# EAGLE design RoboSkinRev1 (EAGLE 9.4.2)
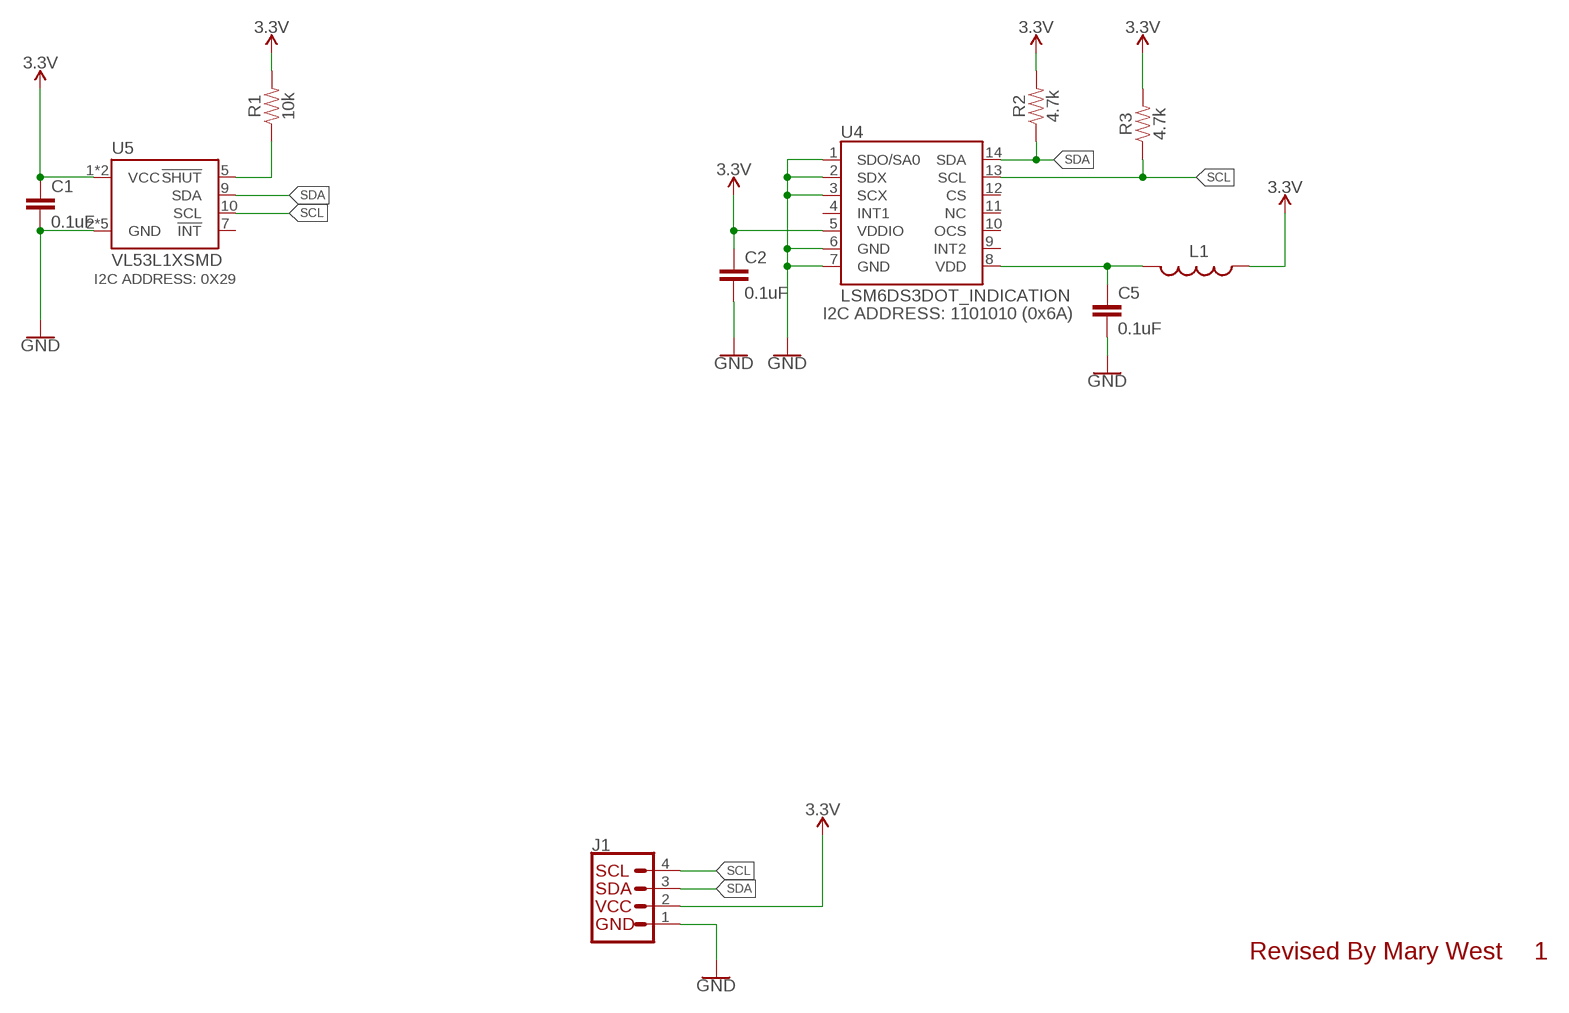
[diagram p0: schematic, sheet 1]

## Parts
C1  0.1uF  0.1UF-0603-25V-(+80/-20%)  [0603]
C2  0.1uF  0.1UF-0603-25V-(+80/-20%)  [0603]
C5  0.1uF  0.1UF-0603-25V-(+80/-20%)  [0603]
J1  QWIIC_CONNECTORJS-1MM  [1X04_1MM_RA]
L1  RES-07859  INDUCTOR30OHM,1.8A  [0603]
R1  10k  10KOHM-0603-1/10W-1%  [0603]
R2  4.7k  4.7KOHM-0603-1/10W-1%  [0603]
R3  4.7k  4.7KOHM-0603-1/10W-1%  [0603]
U4  LSM6DS3DOT_INDICATION  [LGA14L_DOT_INDICATOR]
U5  VL53L1XSMD  [VL53L1X]

## Nets
3.3V: C1.1 C2.1 J1.2(VCC) L1.1 R1.2 R2.2 R3.2 U4.5(VDDIO) U5.1(VCC) U5.11(VCC)
GND: C1.2 C2.2 C5.2 J1.1(GND) U4.1(SDO/SA0) U4.2(SDX) U4.3(SCX) U4.6(GND) U4.7(GND) U5.2(GND) U5.3(GND) U5.4(GND) U5.6(GND) U5.12(GND)
N$3: R1.1 U5.5(!SHUT)
N$6: C5.1 L1.2 U4.8(VDD)
SCL: J1.4(SCL) R3.1 U4.13(SCL) U5.10(SCL)
SDA: J1.3(SDA) R2.1 U4.14(SDA) U5.9(SDA)
Unconnected: U4.4(INT1) U4.9(INT2) U4.10(OCS) U4.11(NC) U4.12(CS) U5.7(!INT)

## Notes on the sheet
- I2C ADDRESS: 0X29
- I2C ADDRESS: 1101010 (0x6A)
- Revised By Mary West | 1

## Library data of the parts
C1 C2 C5 = SparkFun-Capacitors:0.1UF: 0.1µF ceramic capacitors A capacitor is a passive two-terminal electrical component used to store electrical energy temporarily in an electric field.; PROD_ID: CAP-00810
J1 = SparkFun-Connectors:QWIIC_CONNECTOR: SparkFun I2C Standard Qwiic Connector An SMD 1mm pitch JST connector makes it easy and quick (get it? Qwiic?) to connect I2C devices to each other. The Qwiic system <http://www.sparkfun.com/qwiic> enables fast and solderless connection between popular platforms and various sensors and actuators. We carry 200mm <https://www.sparkfun.com/products/14204>, 100mm <https://www.sparkfun.com/products/14205>, 50mm <https://www.sparkfun.com/products/14206>, and breadboard friendly <https://www.sparkfun.com/products/14207> Qwiic cables. We also offer 10 pcs strips <https://www.sparkfun.com/products/14323> the SMD connectors.
L1 = SparkFun-Passives:INDUCTOR: Inductors Basic Inductor/Choke - 0603 and 1206. Footprints are not proven and vary greatly between part numbers. SRN6045- 33uH, 20% 1.4A SDR0403-560KL - 56uH, 10%, 500mA RMS/740mA peak; PROD_ID: RES-07859
R1 = SparkFun-Resistors:10KOHM: 10kΩ resistor A resistor is a passive two-terminal electrical component that implements electrical resistance as a circuit element. Resistors act to reduce current flow, and, at the same time, act to lower voltage levels within circuits. - Wikipedia; PROD_ID: RES-00824
R2 R3 = SparkFun-Resistors:4.7KOHM: 4.7kΩ resistor A resistor is a passive two-terminal electrical component that implements electrical resistance as a circuit element. Resistors act to reduce current flow, and, at the same time, act to lower voltage levels within circuits. - Wikipedia; PROD_ID: RES-07857
U4 = LSM6DS3:LSM6DS3; PROD_ID: IC-12969
U5 = SparkFun-Sensors:VL53L1X: STMicroelectronics VL53L1X - 400 cm IR Laser ToF Sensor VL53L1X is a state-of-the-art ToF laser-ranging sensor, enhancing the ST FlightSense product family. It is the fastest miniature ToF sensor currently on the market with accurate ranging up to 4 m and fast ranging frequency (up to 50 Hz). Housed in a miniature and reflowable package, it integrates a single photon avalanche diode (SPAD) receiving array, a 940 nm invisible laser Class 1 emitter, physical infrared filters, and optics to achieve the best ranging performance in various ambient lighting conditions with a range of cover window options.; PROD_ID: IC-13960

## Net classes
0 default: clearance 0.205 mm

## Board
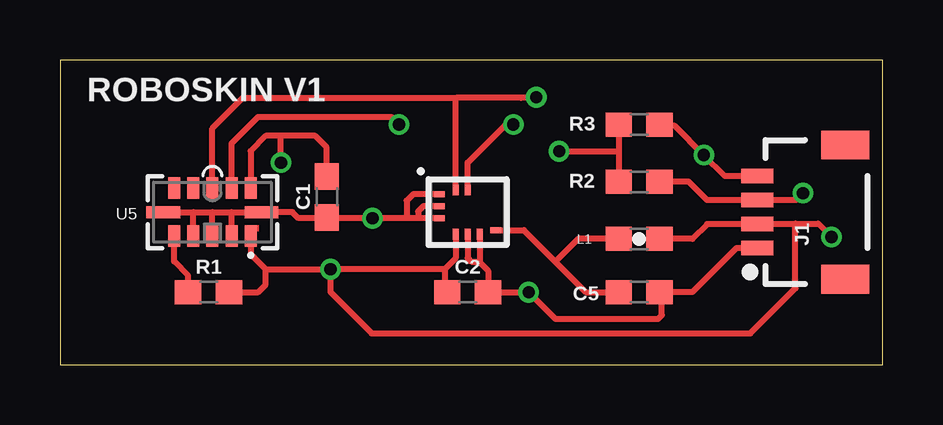
[diagram p1: board, top side]
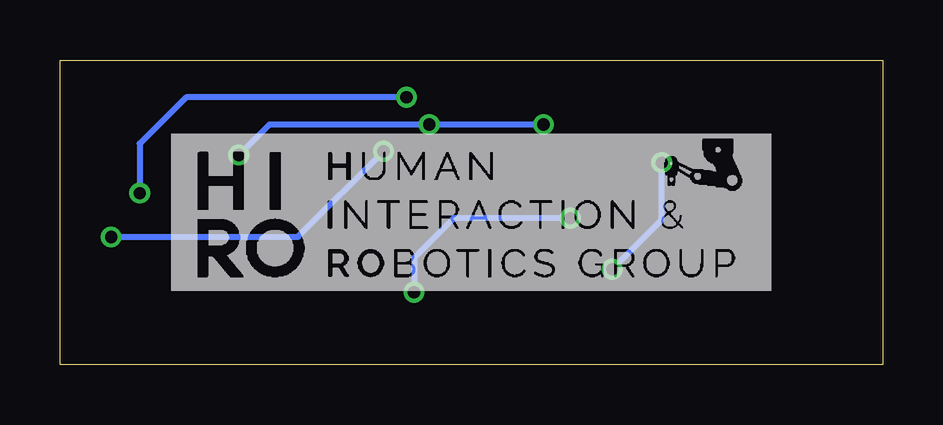
[diagram p2: board, bottom side, seen from below]

Size 34.28 x 12.69 mm. Coordinates in mm from the lower left corner, seen from the top.
Outline: 0,0 34.28,0 34.28,12.69 0,12.69 0,0
Copper layers (1*16): Top 0.035mm / dielectric 1.5mm / Bottom 0.035mm
Design rules "SparkFun-2-layer-TIGHT": minimum track width 7mil, minimum drill 15mil, track to track 7mil, track to pad 7mil, pad to pad 7mil, via to via 7mil, smd to smd 7mil, copper to edge 7mil, drill to drill 7mil, minimum pad ring 7mil, minimum via ring 7mil, stop-mask expansion 4mil, vias tented up to drill 25mil, thermal gap 10mil

### Footprints (pad centres in the part's own frame; a part is rotated, then mirrored left to right if it is on the bottom)
0603 = smd 1.1 x 1: 1 -0.85,0; 2 0.85,0
1X04_1MM_RA = smd 0.6 x 1.35: 1 -1.5,0; 2 -0.5,0; 3 0.5,0; 4 1.5,0 | smd 1.2 x 2: NC1 2.8,-3.675; NC2 -2.8,-3.675
LGA14L_DOT_INDICATOR = smd 0.45 x 0.25: 1 -1.175,0.75; 2 -1.175,0.25; 3 -1.175,-0.25; 8 1.175,-0.75 | smd 0 x 0: 4 -1.175,-0.75; 9 1.175,-0.25; 10 1.175,0.25; 11 1.175,0.75; 12 0.5,0.925 | smd 0.25 x 0.45: 5 -0.5,-0.925; 6 0,-0.925; 7 0.5,-0.925; 13 0,0.925; 14 -0.5,0.925
VL53L1X = smd 0.5 x 0.9: 1 1.6,-1; 2 0.8,-1; 3 0,-1; 4 -0.8,-1; 5 -1.6,-1; 7 -1.6,1; 8 -0.8,1; 9 0,1; 10 0.8,1; 11 1.6,1 | smd 1.4 x 0.5: 6 -2.05,0; 12 2.05,0

### Placement (x,y rotation side)
C1  11.11,6.99 270 top
C2  16.99,3.02 0 top
C5  24.13,3.02 0 top
J1  29.05,6.35 90 top
L1  24.13,5.24 180 top
R1  6.19,3.02 0 top
R2  24.13,7.62 180 top
R3  24.13,10 180 top
U4  16.99,6.35 0 top
U5  6.35,6.35 0 top
U$1  [CAPTURE#PNG]  17.14,6.35 0 bottom

### Tracks (layer width: path | path; a pad name or v marks a point on that pad's centre or on a via)
3.3V  (via drill 0.51)
  Top 0.254: U4.5 16.49,4.42 16.03,3.97 | 16.03,3.97 16.03,3.28 16.14,3.17 C2.1 | L1.1 26.35,5.24 26.96,5.85 J1.2 29.07,5.87 30.64,5.87 | U5.1 7.95,4.62 7.94,4.6 8.57,3.97 | 8.57,3.97 v11.27,3.97 | 16.03,3.97 v11.27,3.97 | R1.2 8.26,3.02 8.57,3.33 8.57,3.97 | R3.2 23.28,8.89 | 23.28,8.89 R2.2 | v32.15,5.32 31.59,5.87 30.64,5.87 | 30.64,5.87 30.64,3.17 28.77,1.3 12.99,1.3 11.27,3.02 v11.27,3.97 | C1.1 11.11,9.05 10.64,9.53 9.21,9.53 | 9.21,9.53 8.57,9.53 7.94,8.89 7.94,7.36 U5.11 | v20.8,8.89 23.28,8.89 | v9.21,8.41 9.21,9.53
  Bottom 0.254: v32.15,5.32 24.37,5.32 v20.8,8.89 | v11.27,3.97 9.21,6.03 v9.21,8.41
GND  (via drill 0.51)
  Top 0.254: U4.7 17.49,4.29 | 17.49,4.29 17.49,4.26 17.84,3.91 C2.2 v19.53,3.02 20.64,1.91 24.92,1.91 25.08,2.06 25.08,3.02 | U4.6 16.99,4.45 17.14,4.29 17.49,4.29 | U4.3 14.92,6.1 | 14.92,6.1 14.45,6.1 | 11.08,6.1 v13.02,6.1 14.45,6.1 | U4.2 15.15,6.6 15.14,6.6 14.92,6.38 14.92,6.1 | U4.1 14.72,7.1 14.45,6.83 14.45,6.1 | U5.6 5.56,6.35 | 5.56,6.35 6.35,6.35 | 6.35,6.35 7.14,6.35 | 7.14,6.35 U5.12 9.68,6.35 9.93,6.1 11.08,6.1 | U5.4 5.56,6.35 | U5.3 6.35,6.35 | U5.2 7.15,6.34 7.14,6.35 | J1.1 28.19,4.85 26.35,3.02 25.08,3.02 | 25.08,3.02 C5.2 | C1.2 11.08,6.1
  Bottom 0.254: v13.02,6.1 17.87,6.1 19.53,4.45 v19.53,3.02
N$3
  Top 0.254: R1.1 5.34,3.71 4.75,4.3 U5.5
N$6
  Top 0.254: U4.8 19.32,5.6 20.64,4.29 | 20.64,4.29 21.91,3.02 C5.1 | 20.64,4.29 21.59,5.24 L1.2
SCL  (via drill 0.51)
  Top 0.254: R3.1 24.98,9.95 25.61,9.95 v26.83,8.73 27.71,7.85 J1.4 | U5.10 7.15,9.21 8.26,10.32 13.81,10.32 v14.13,10 | U4.13 16.99,8.41 18.57,10 v18.89,10
  Bottom 0.254: v14.13,10 v18.89,10 25.56,10 v26.83,8.73
SDA  (via drill 0.51)
  Top 0.254: R2.1 26.19,7.62 26.96,6.85 J1.3 30.66,6.85 v30.96,7.14 | U5.9 6.35,9.84 7.62,11.11 16.51,11.11 | U4.14 16.49,11.09 16.51,11.11 | 16.51,11.11 19.21,11.11 19.23,11.14 v19.84,11.14
  Bottom 0.254: v19.84,11.14 29.03,11.14 30.96,9.21 v30.96,7.14

### Text on the board
tPlace: ROBOSKIN V1
Measures: LSM6DS3